# EAGLE design CTRL (EAGLE 7.6.0)
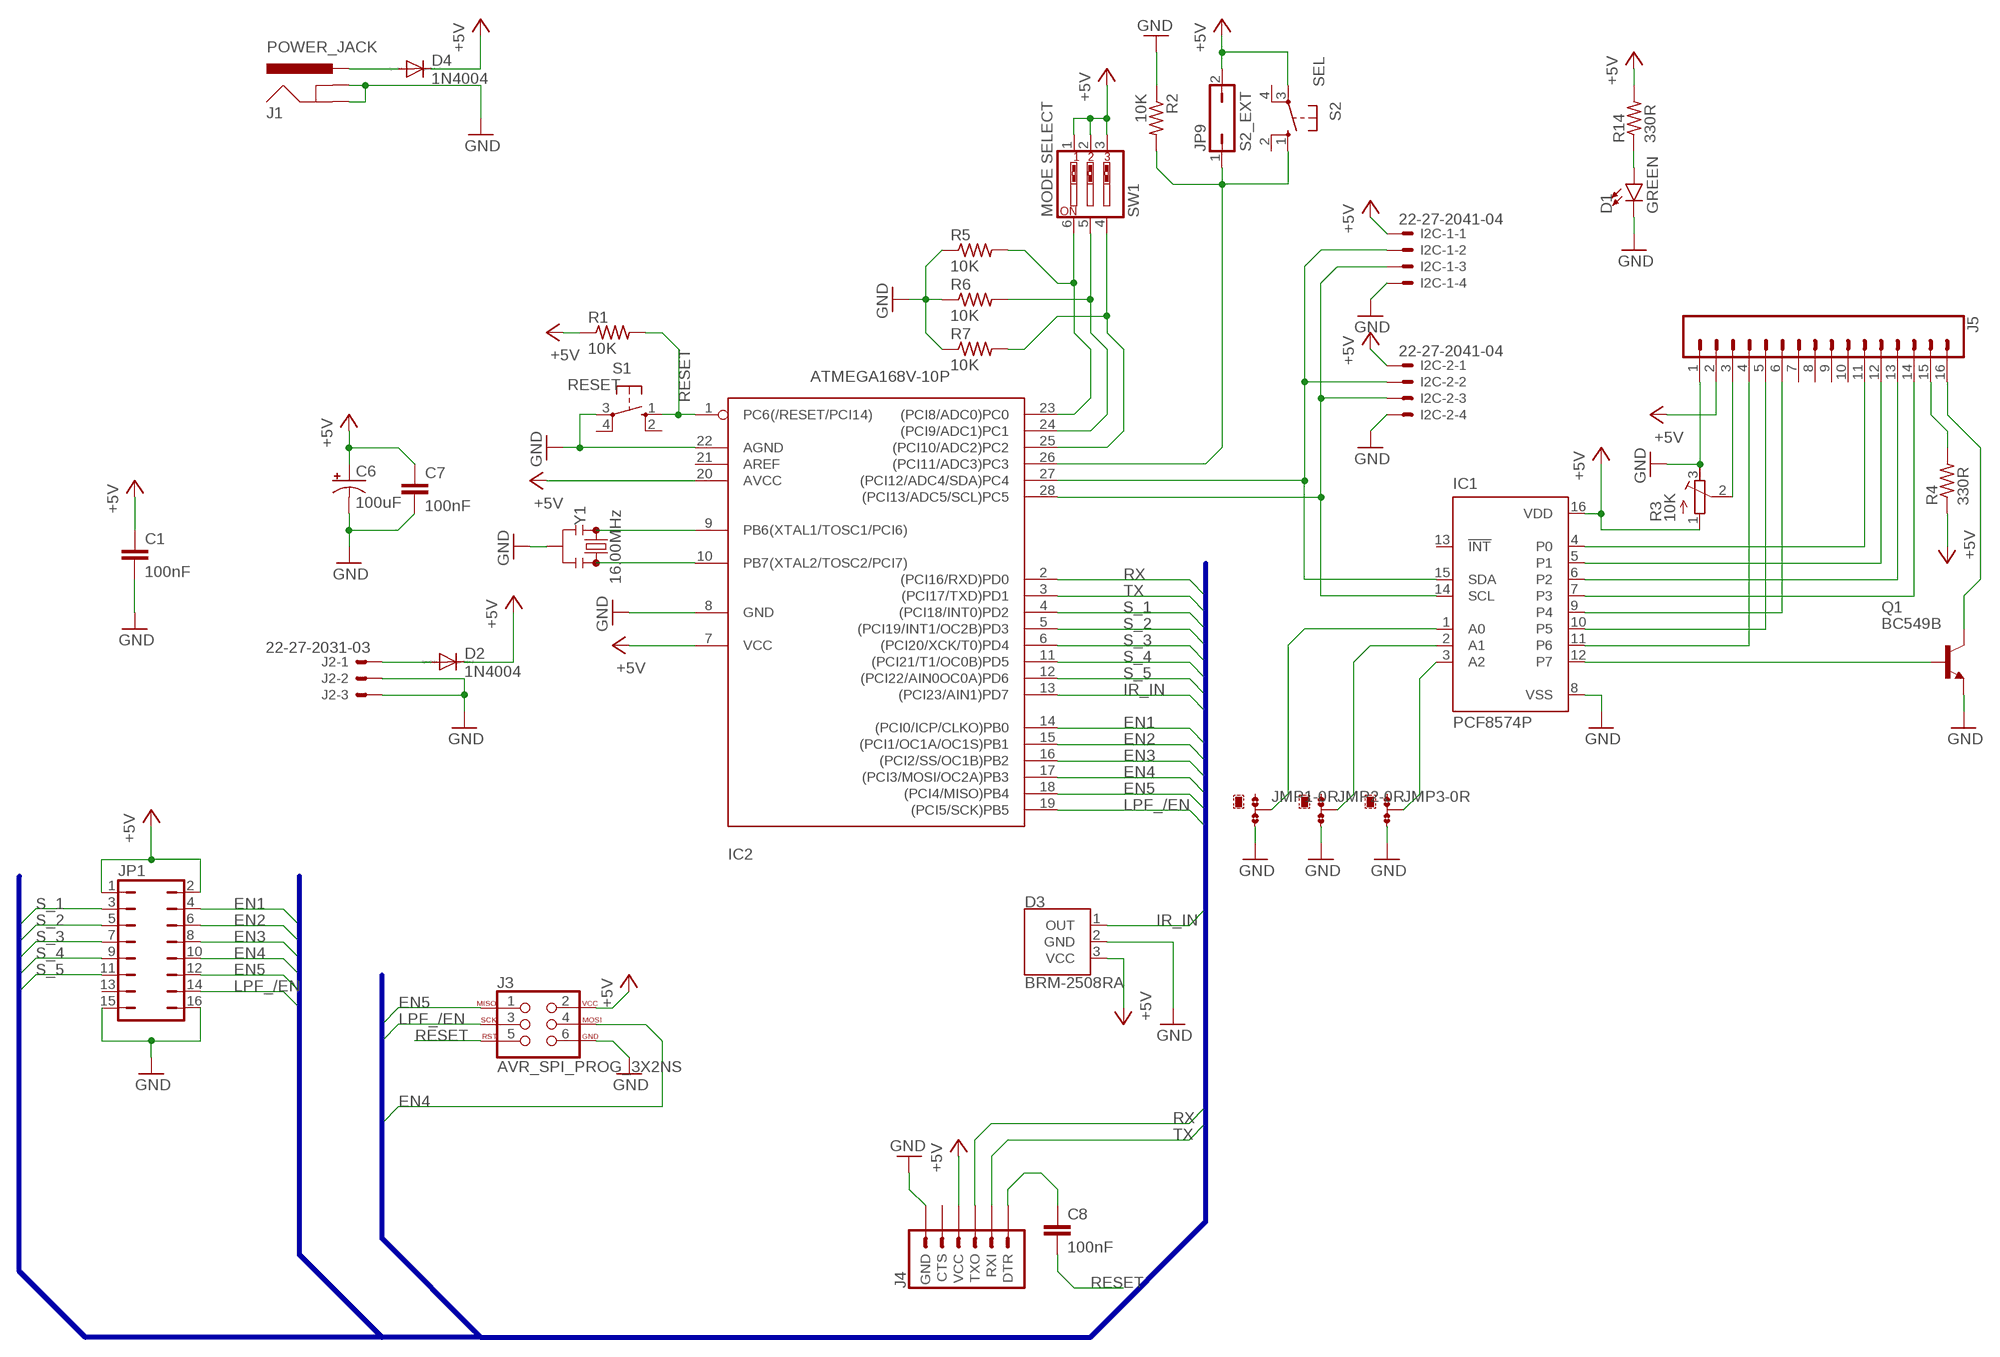
[diagram p0: schematic, sheet 1]

## Parts
C1  100nF  C-EU075-032X103  [C075-032X103]
C6  100uF  CPOL-USE2.5-7  [E2,5-7]
C7  100nF  C-EU075-032X103  [C075-032X103]
C8  100nF  C-EU075-032X103  [C075-032X103]
D1  GREEN  LED5MM  [LED_5MM]
D2  1N4004  [DO41-10]
D3  BRM-2508RA  [BRM-2508]
D4  1N4004  [DO41-10]
I2C-1  22-27-2041-04  [6410-04]
I2C-2  22-27-2041-04  [6410-04]
IC1  PCF8574P  [DIL16]
IC2  ATMEGA168V-10P  [DIL28-3]
J1  POWER_JACK  [POWER_JACK_PTH]
J2  22-27-2031-03  [6410-03]
J3  AVR_SPI_PROG_3X2NS  [2X3-NS]
J4  6_PIN_SERIAL_TARGETSILK  [6_PIN_SERIAL_TARGET_SIDE_W_SILK]
J5  CONN_16LONGPADS  [1X16_LONGPADS]
JMP1  0R-JUMPB  [B0R-JMP]
JMP2  0R-JUMPB  [B0R-JMP]
JMP3  0R-JUMPB  [B0R-JMP]
JP1  JP8Q  [JP8Q]
JP9  S2_EXT  JP1Q  [JP1]
Q1  BC549B  [TO92-EBC]
R1  10K  R-US_0204/7  [0204/7]
R2  10K  R-US_0204/7  [0204/7]
R3  10K  R-TRIMM3296P  [RTRIM3296P]
R4  330R  R-US_0204/7  [0204/7]
R5  10K  R-US_0204/7  [0204/7]
R6  10K  R-US_0204/7  [0204/7]
R7  10K  R-US_0204/7  [0204/7]
R14  330R  R-US_0204/7  [0204/7]
S1  RESET  10-XX  [B3F-10XX]
S2  SEL  10-XX  [B3F-10XX]
SW1  MODE SELECT  SW_DIP-3  [EDG-03]
Y1  16.00MHz  RESONATORPTH-7.6X3.8  [RESONATOR-PTH-7.6X3.8]

## Nets
+5V [PWR]: C1.1 C6.+ C7.1 D2.C D3.3(VCC) D4.C I2C-1.1 I2C-2.1 IC1.16(VDD) IC2.7(VCC) IC2.20(AVCC) J3.2 J4.P$4(VCC) J5.2 JP1.1 JP1.2 JP9.2 R1.1 R3.1(A) R4.1 R14.2 S2.3(P) SW1.1 SW1.2 SW1.3
EN1: IC2.14((PCI0/ICP/CLKO)PB0) JP1.4
EN2: IC2.15((PCI1/OC1A/OC1S)PB1) JP1.6
EN3: IC2.16((PCI2/SS/OC1B)PB2) JP1.8
EN4: IC2.17((PCI3/MOSI/OC2A)PB3) J3.4 JP1.10
EN5: IC2.18((PCI4/MISO)PB4) J3.1 JP1.12
GND: C1.2 C6.- C7.2 D1.K(C) D3.2(GND) I2C-1.4 I2C-2.4 IC1.8(VSS) IC2.8(GND) IC2.22(AGND) J1.GND J1.GNDBREAK J2.2 J2.3 J3.6 J4.P$6(GND) J5.1 JMP1.3 JMP2.3 JMP3.3 JP1.15 JP1.16 Q1.E R2.1 R3.3(E) R5.1 R6.1 R7.1 S1.3(P) Y1.2
IR_IN: D3.1(OUT) IC2.13((PCI23/AIN1)PD7)
LPF_/EN: IC2.19((PCI5/SCK)PB5) J3.3 JP1.14
N$1: IC2.9(PB6(XTAL1/TOSC1/PCI6)) Y1.1
N$2: IC2.10(PB7(XTAL2/TOSC2/PCI7)) Y1.3
N$5: IC1.1(A0) JMP1.2
N$6: IC1.2(A1) JMP2.2
N$7 [PWR]: D4.A J1.PWR
N$8: IC1.3(A2) JMP3.2
N$9: I2C-1.2 I2C-2.2 IC1.15(SDA) IC2.27((PCI12/ADC4/SDA)PC4)
N$10: I2C-1.3 I2C-2.3 IC1.14(SCL) IC2.28((PCI13/ADC5/SCL)PC5)
N$11: IC2.26((PCI11/ADC3)PC3) JP9.1 R2.2 S2.1(S)
N$12: IC2.23((PCI8/ADC0)PC0) R5.2 SW1.6
N$13: IC2.24((PCI9/ADC1)PC1) R6.2 SW1.5
N$14: IC2.25((PCI10/ADC2)PC2) R7.2 SW1.4
N$15: C8.1 J4.P$1(DTR)
N$16: D1.A R14.1
N$17 [PWR]: D2.A J2.1
N$18: IC1.4(P0) J5.11
N$19: IC1.5(P1) J5.12
N$20: IC1.6(P2) J5.13
N$21: IC1.7(P3) J5.14
N$22: IC1.9(P4) J5.6
N$23: IC1.10(P5) J5.5
N$24: IC1.11(P6) J5.4
N$25: J5.3 R3.2(S)
N$26: IC1.12(P7) Q1.B
N$27: J5.16 Q1.C
N$28: J5.15 R4.2
RESET: C8.2 IC2.1(PC6(/RESET/PCI14)) J3.5 R1.2 S1.1(S)
RX: IC2.2((PCI16/RXD)PD0) J4.P$2(TXO)
S_1: IC2.4((PCI18/INT0)PD2) JP1.3
S_2: IC2.5((PCI19/INT1/OC2B)PD3) JP1.5
S_3: IC2.6((PCI20/XCK/T0)PD4) JP1.7
S_4: IC2.11((PCI21/T1/OC0B)PD5) JP1.9
S_5: IC2.12((PCI22/AIN0OC0A)PD6) JP1.11
TX: IC2.3((PCI17/TXD)PD1) J4.P$3(RXI)
Unconnected: IC1.13(!INT) IC2.21(AREF) J4.P$5(CTS) J5.7 J5.8 J5.9 J5.10 JMP1.1 JMP2.1 JMP3.1 JP1.13 S1.2(S1) S1.4(P1) S2.2(S1) S2.4(P1)

## Buses
B$1

## Library data of the parts
C1 C7 C8 = rcl:C-EU: CAPACITOR, European symbol
C6 = rcl:CPOL-US: POLARIZED CAPACITOR, American symbol
D1 = SparkFun-LED:LED: LED (Generic) Standard schematic elements and footprints for 5mm, 3mm, 1206, and 0603 sized LEDs. Generic LEDs with no color specified.
D2 D4 = diode:1N4004: DIODE general purpose rectifier, 1 A
D3 = SparkFun-Sensors:BRM-2508: BRM-2508 IR Receiver Module 2.7V/5.5V IR Receiver with Low Power Consumption, High-immunity Against Ambient Light. Example Datasheet <http://www.sinoskysun.com/upload/20110512/201105120447164615.PDF>; PROD_ID: COMP-12059
I2C-1 I2C-2 = con-molex:22-?-04: CONNECTOR wire to board 2.54 mm (.1 inch) pitch header; OC_FARNELL: unknown; OC_NEWARK: unknown
IC1 = micro-philips:PCF8574: I2C-Bus Remote 8-bit I/O expander http://www.semiconductors.philips.com/acrobat_download/datasheets/PCF8574_4.pdf; MPN: PCF8574PN; OC_FARNELL: 204020; OC_NEWARK: 11N8515
IC2 = adafruit:ATMEGA168*P: MICROCONTROLLER 16 kBytes FLASH 1 kBytes SRAM 512 Bytes EEPROM USART 8-channel 10 bit ADC
J1 = SparkFun-Connectors:POWER_JACK: Power Jack Connector This is the standard 5.5mm barrel jack for power. The PTH is the most common, proven, reliable, footprint. The Slot footprint only works if the mill layer is transmitted to the PCB fab house so be warned. Here are the connectors we sell at SparkFun: DC Barrel Power Jack/Connector <https://www.sparkfun.com/products/119> (PRT-00119) DC Barrel Power Jack/Connector (SMD) <https://www.sparkfun.com/products/12748> (PRT-12748) DC Barrel Jack Adapter - Breadboard Compatible <https://www.sparkfun.com/products/10811> (PRT-10811) It is used on this SparkFun product (and many, many others): SparkFun RedBoard - Programmed with Arduino <https://www.sparkfun.com/products/12757> (DEV-12757) Also, if you need a mating power supply or connector, please check these out: Wall Adapter Power Supply - 9VDC 650mA <https://www.sparkfun.com/products/298> (TOL-00298) DC Barrel Jack Adapter - Male <https://www.sparkfun.com/products/10287> (PRT-10287); PROD_ID: CONN-08197
J2 = con-molex:22-?-03: CONNECTOR wire to board 2.54 mm (.1 inch) pitch header; OC_FARNELL: unknown; OC_NEWARK: unknown
J3 = SparkFun-Connectors:AVR_SPI_PROG_3X2: AVR ISP 6 Pin This is the reduced ISP connector for AVR programming. Common on Arduino. This footprint will take up less PCB space and can be used with a 10-pin to 6-pin adapter such as SKU: BOB-08508 **Special note about "TEST_POINT" package. The stop mask is on the top side, so if you want your programming test points to be on the bottom of your board, make sure to place this package on the bottom side of the board. This also ensure that the orientation to program from the bottom side will be correct. SparkFun Products: SparkFun ISP Pogo Adapter <https://www.sparkfun.com/products/11591> - NS Tiny AVR Programmer <https://www.sparkfun.com/products/11801> -PTH
J4 = SparkFun-Connectors:6_PIN_SERIAL_TARGET: 6-pin header connection for use with the "FTDI BASIC" pinout - TARGET SIDE. Also known as "Arduino Serial Program Header". It is used to mate with our FTDI Basic serial programmers using the Arduino IDE. Note, this device has "TARGET" in the name. It is intended to be used on a design that contains a target micro-controller that you wish to program. The "sister" device, named "CABLE" is inteneded to be used on a design that usually lives on the end of your USB cable and prvides the converter chip (FTDI232 or FTDI231x) to commnicate serial RX/TX. You can populate with some of these: Break Away Headers - Straight <https://www.sparkfun.com/products/116> (PRT-00116) For reference (or to suit your programming needs) check out these designs: SparkFun FTDI Basic Breakout - 5V <https://www.sparkfun.com/products/9716> (DEV-09716) SparkFun FTDI Basic Breakout - 3.3V <https://www.sparkfun.com/products/9873> (DEV-09873) SparkFun FTDI SmartBasic <https://www.sparkfun.com/products/12935> (DEV-12935) SparkFun Beefy 3 - FTDI Basic Breakout <https://www.sparkfun.com/products/13746> (DEV-13746)
J5 = SparkFun-Connectors:CONN_16: Multi connection point. Often used as Generic Header-pin footprint for 0.1 inch spaced/style header connections On any of the 0.1 inch spaced packages, you can populate with these: Break Away Headers - Straight <https://www.sparkfun.com/products/116> (PRT-00116) Break Away Male Headers - Right Angle <https://www.sparkfun.com/products/553> (PRT-00553) Female Headers <https://www.sparkfun.com/products/115> (PRT-00115) Break Away Headers - Machine Pin <https://www.sparkfun.com/products/117> (PRT-00117) Break Away Female Headers - Swiss Machine Pin <https://www.sparkfun.com/products/743> (PRT-00743) For SCREWTERMINALS and SPRING TERMINALS visit here: Screw Terimnals on SparkFun.com <https://www.sparkfun.com/search/results?term=Screw+Terminals> (5mm/3.5mm/2.54mm spacing) This device is also useful as a general connection point to wire up your design to another part of your project. Our various solder wires solder well into these plated through hole pads. Hook-Up Wire - Assortment (Stranded, 22 AWG) <https://www.sparkfun.com/products/11375> (PRT-11375) Hook-Up Wire - Assortment (Solid Core, 22 AWG) <https://www.sparkfun.com/products/11367> (PRT-11367) View the entire wire category on our website here <https://www.sparkfun.com/categories/141> Special notes: Molex polarized connector foot print use with SKU : PRT-08231 with associated crimp pins and housings. 1MM SMD Version SKU: PRT-10208 NOTES ON THE VARIANTS LOCK and LOCK_LONGPADS... This footprint was designed to help hold the alignment of a through-hole component (i.e. 6-pin header) while soldering it into place. You may notice that each hole has been shifted either up or down by 0.005 of an inch from it's more standard position (which is a perfectly straight line). This slight alteration caused the pins (the squares in the middle) to touch the edges of the holes. Because they are alternating, it causes a "brace" to hold the component in place. 0.005 has proven to be the perfect amount of "off-center" position when using our standard breakaway headers. Although looks a little odd when you look at the bare footprint, once you have a header in there, the alteration is very hard to notice. Also,if you push a header all the way into place, it is covered up entirely on the bottom side.
JMP1-JMP3 = jump-0r-smd:0R-JUMP: SMD 0R 0805 Jumper
JP1 = jumper:JP8Q: JUMPER
JP9 = jumper:JP1Q: JUMPER
Q1 = transistor-npn:BC549*: NPN Transistor
R1 R2 R5-R7 = rcl:R-US_: RESISTOR, American symbol
R3 = resistor:R-TRIMM: Trimm resistor
R4 R14 = resistor:R-US_: RESISTOR, American symbol
S1 S2 = switch-omron:10-XX: OMRON SWITCH; MPN: B3F-1000; OC_FARNELL: 176432; OC_NEWARK: 36M3542
SW1 = special:SW_DIP-3: DIP SWITCH
Y1 = SparkFun-Clocks:RESONATOR: Resonators (Generic) Ceramic resonators are clock-generating components, often used to control timing in microcontrollers. They usually have 3 pins: two pins for oscillation, and one pin for ground. Compared to crystals, resonators have worse tolerance, but are usually much cheaper. Plus, they have built-in load capacitors! These devices are used on boards like the Arduino Pro 8MHz <https://www.sparkfun.com/products/11114> and Arduino Pro 16MHz <https://www.sparkfun.com/products/11113>.

## Net classes
0 default: width 0.406 mm
1 PWR: width 1 mm

## Board
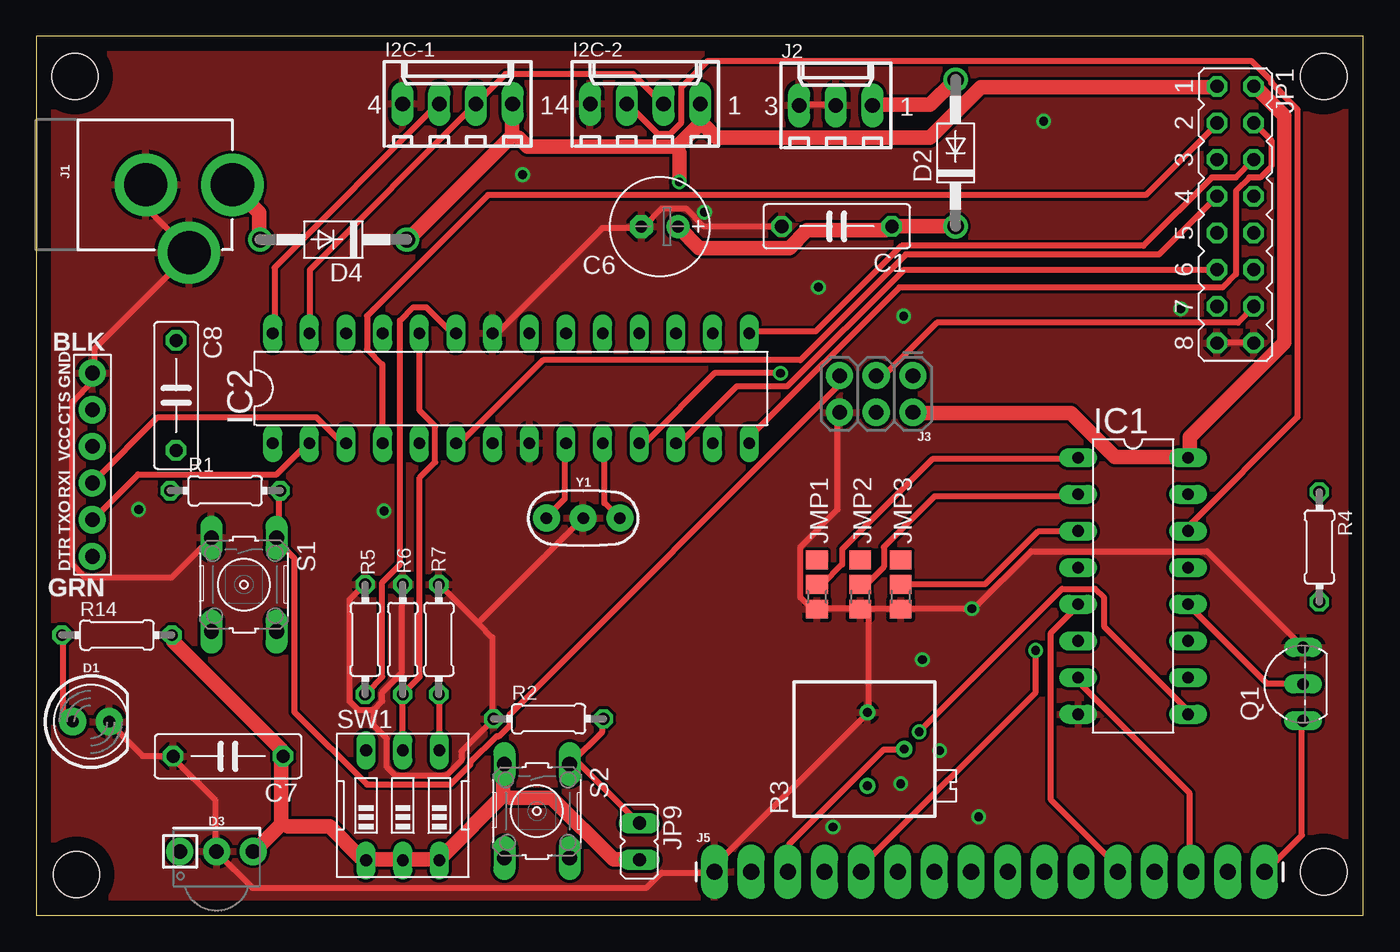
[diagram p1: board, top side]
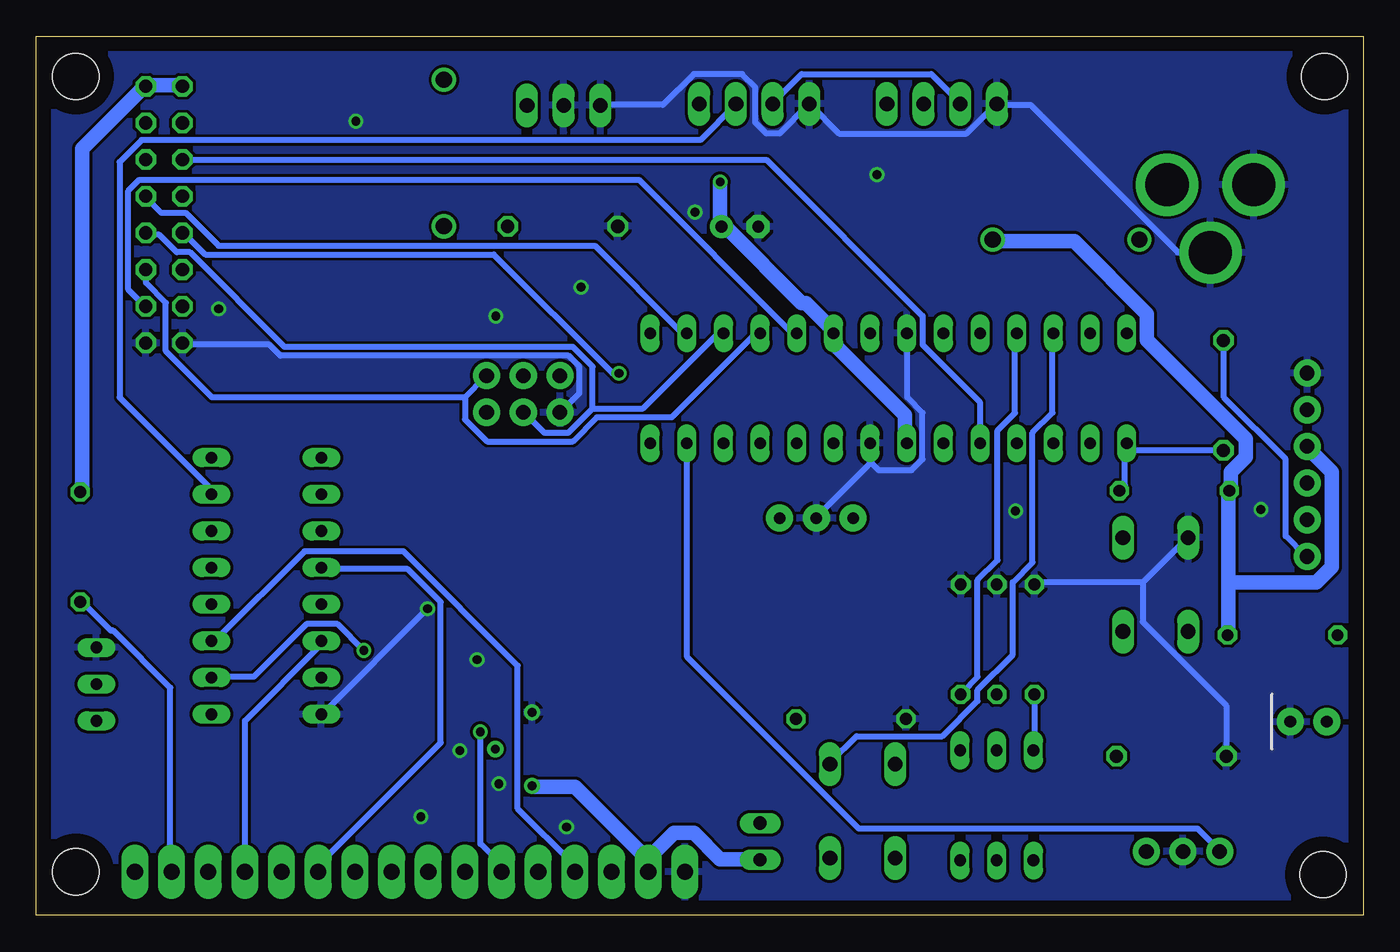
[diagram p2: board, bottom side, seen from below]

Size 91.95 x 60.93 mm. Coordinates in mm from the lower left corner, seen from the top.
Outline: 0,0 91.95,0 91.95,60.93 0,60.93 0,0
Copper layers (1*16): Top 0.035mm / dielectric 1.5mm / Bottom 0.035mm
Design rules "default": minimum track width 10mil, minimum drill 24mil, track to track 8mil, track to pad 8mil, pad to pad 8mil, via to via 8mil, smd to smd 8mil, copper to edge 40mil, drill to drill 8mil, minimum pad ring 10mil, minimum via ring 8mil, stop-mask expansion 4mil, vias tented up to drill 0mil, thermal gap 10mil
Holes 3.2 mm at 2.7,58.13 2.8,2.83 89.2,3.03 89.2,58.13

### Footprints (pad centres in the part's own frame; a part is rotated, then mirrored left to right if it is on the bottom)
C075-032X103 = drill 0.914 octagon: 1 -3.81,0; 2 3.81,0
E2,5-7 = drill 0.813 pad 1.6: + -1.27,0 | drill 0.813 pad 1.6 octagon: - 1.27,0
LED_5MM = drill 0.813 pad 1.88: A -1.27,0; K 1.27,0
DO41-10 = drill 1.118: A 5.08,0; C -5.08,0
BRM-2508 = drill 1.016 pad 1.88: 1 -2.54,0; 2 0,0; 3 2.54,0
6410-04 = drill 1.016 long: 1 3.81,0; 2 1.27,0; 3 -1.27,0; 4 -3.81,0
DIL16 = drill 0.813 long: 1 -8.89,-3.81; 2 -6.35,-3.81; 3 -3.81,-3.81; 4 -1.27,-3.81; 5 1.27,-3.81; 6 3.81,-3.81; 7 6.35,-3.81; 8 8.89,-3.81; 9 8.89,3.81; 10 6.35,3.81; 11 3.81,3.81; 12 1.27,3.81; 13 -1.27,3.81; 14 -3.81,3.81; 15 -6.35,3.81; 16 -8.89,3.81
DIL28-3 = drill 0.813 long: 1 -16.51,-3.81; 2 -13.97,-3.81; 3 -11.43,-3.81; 4 -8.89,-3.81; 5 -6.35,-3.81; 6 -3.81,-3.81; 7 -1.27,-3.81; 8 1.27,-3.81; 9 3.81,-3.81; 10 6.35,-3.81; 11 8.89,-3.81; 12 11.43,-3.81; 13 13.97,-3.81; 14 16.51,-3.81; 15 16.51,3.81; 16 13.97,3.81; 17 11.43,3.81; 18 8.89,3.81; 19 6.35,3.81; 20 3.81,3.81; 21 1.27,3.81; 22 -1.27,3.81; 23 -3.81,3.81; 24 -6.35,3.81; 25 -8.89,3.81; 26 -11.43,3.81; 27 -13.97,3.81; 28 -16.51,3.81
POWER_JACK_PTH = drill 2.997 pad 4.318: GND 0,7.7; GNDBREAK 4.7,10.7; PWR 0,13.7
6410-03 = drill 1.016 long: 1 2.54,0; 2 0,0; 3 -2.54,0
2X3-NS = drill 1.016 pad 1.88: 1 -2.54,-1.27; 2 -2.54,1.27; 3 0,-1.27; 4 0,1.27; 5 2.54,-1.27; 6 2.54,1.27
6_PIN_SERIAL_TARGET_SIDE_W_SILK = drill 1.016 pad 1.88: P$1 -6.35,0; P$2 -3.81,0; P$3 -1.27,0; P$4 1.27,0; P$5 3.81,0; P$6 6.35,0
1X16_LONGPADS = drill 1.118 pad 1.88 long: 1 0,0; 2 2.54,0; 3 5.08,0; 4 7.62,0; 5 10.16,0; 6 12.7,0; 7 15.24,0; 8 17.78,0; 9 20.32,0; 10 22.86,0; 11 25.4,0; 12 27.94,0; 13 30.48,0; 14 33.02,0; 15 35.56,0; 16 38.1,0
B0R-JMP = smd 1.5 x 1.3: 1 0,1.7; 2 0,0; 3 0,-1.7
JP8Q = drill 0.914 octagon: 1 -8.89,-1.27; 2 -8.89,1.27; 3 -6.35,-1.27; 4 -6.35,1.27; 5 -3.81,-1.27; 6 -3.81,1.27; 7 -1.27,-1.27; 8 -1.27,1.27; 9 1.27,-1.27; 10 1.27,1.27; 11 3.81,-1.27; 12 3.81,1.27; 13 6.35,-1.27; 14 6.35,1.27; 15 8.89,-1.27; 16 8.89,1.27
JP1 = drill 0.914 long: 1 0,-1.27; 2 0,1.27
TO92-EBC = drill 0.813 long: B 0,-1.27; C -2.54,-1.27; E 2.54,-1.27
0204/7 = drill 0.813 octagon: 1 -3.81,0; 2 3.81,0
RTRIM3296P = drill 0.61: 1 0,-2.54; 2 2.54,0; 3 0,2.54
B3F-10XX = drill 1.016 long: 1 -3.251,2.261; 2 3.251,2.261; 3 -3.251,-2.261; 4 3.251,-2.261
EDG-03 = drill 0.813 long: 1 -2.54,-3.81; 2 0,-3.81; 3 2.54,-3.81; 4 2.54,3.81; 5 0,3.81; 6 -2.54,3.81
RESONATOR-PTH-7.6X3.8 = drill 0.8 pad 1.88: 1 -2.54,0; 2 0,0; 3 2.54,0

### Placement (x,y rotation side)
C1  55.47,47.75 180 top
C6  43.2,47.73 180 top
C7  13.3,11.03 180 top
C8  9.7,36.03 270 top
D1  3.8,13.43 0 top
D2  63.7,52.83 90 top
D3  12.5,4.43 0 top
D4  20.6,46.83 180 top
I2C-1  29.2,56.23 0 top
I2C-2  42.2,56.23 0 top
IC1  76,22.83 270 top
IC2  32.9,36.53 0 top
J1  -0.1,50.63 270 top
J2  55.4,56.13 0 top
J3  58.2,36.13 180 top
J4  3.9,31.23 90 top
J5  47,3.03 0 top
JMP1  54.1,22.93 0 top
JMP2  57.1,22.93 0 top
JMP3  59.9,22.93 0 top
JP1  83.08,48.56 270 top
JP9  41.8,5.13 180 top
Q1  86.5,16.03 90 top
R1  13.1,29.43 0 top
R2  35.5,13.63 0 top
R3  57.6,11.53 0 top
R4  88.9,25.53 270 top
R5  22.8,19.13 270 top
R6  25.4,19.13 270 top
R7  27.9,19.13 270 top
R14  5.6,19.43 0 top
S1  14.4,22.93 270 top
S2  34.7,7.23 270 top
SW1  25.4,7.63 0 top
Y1  37.9,27.53 0 top

### Tracks (layer width: path | path; a pad name or v marks a point on that pad's centre or on a via)
+5V  (via drill 0.61)
  Top 1: 16.97,6.33 16.97,10.9 C7.1 16.97,11.51 9.51,18.98 9.51,19.28 R14.2 | 16.97,6.33 15.14,4.5 D3.3 | 32.37,8.31 32.37,10.44 S2.3 | 32.37,8.31 28.25,4.19 SW1.3 27.79,3.89 25.81,3.89 SW1.2 25.36,3.89 22.92,3.89 SW1.1 22.46,4.04 20.33,6.17 17.43,6.17 16.97,6.33 | JP9.2 41.66,3.89 39.99,3.89 35.72,8.15 32.82,8.15 32.37,8.31 | J3.2 60.87,34.82 71.68,34.82 74.73,31.78 79.76,31.78 IC1.16 79.91,32.23 79.91,33.15 86.47,39.7 86.47,55.4 84.49,57.38 JP1.2 | 32.98,54.03 32.98,56.16 I2C-1.1 | 32.98,54.03 25.81,46.86 D4.C | 45.93,54.79 45.93,56.16 I2C-2.1 | 44.41,53.26 45.93,54.79 | 44.41,53.26 34.04,53.26 33.43,53.88 32.98,54.03 | D2.C 63.61,47.78 59.34,47.78 C1.1 58.88,47.47 53.4,47.47 52.18,46.25 45.93,46.25 44.56,47.63 C6.+ | v44.56,50.83 44.56,52.81 44.41,53.26 | JP1.1 81.74,57.38 65.44,57.38 61.93,53.88 47.15,53.88 46.39,54.64 45.93,54.79
  Bottom 1: R3.1 57.51,8.92 54.62,8.92 49.59,3.89 49.59,3.13 J5.2 49.28,4.19 47.76,5.72 46.39,5.72 44.56,3.89 41.82,3.89 JP9.2 | 9.35,23.09 9.35,19.43 R14.2 | 9.35,23.09 9.35,29.34 R1.1 9.2,29.95 9.2,30.71 8.13,31.78 8.13,33 14.99,39.85 14.99,41.68 20.02,46.71 25.66,46.71 D4.C | 9.35,23.09 3.26,23.09 2.19,24.16 2.19,30.71 3.87,32.39 J4.P$4 | R4.1 88.75,29.49 88.75,53.11 84.49,57.38 JP1.2 83.88,57.53 81.9,57.53 JP1.1 | IC2.7 31.76,32.84 31.76,34.67 36.63,39.55 36.63,40.31 IC2.20 36.94,40.77 38.61,42.45 38.92,42.45 44.1,47.63 44.41,47.63 C6.+ 44.56,48.24 v44.56,50.83
EN1
  Top 0.406: IC2.14 49.44,32.84 49.44,33.15 59.8,43.51 82.2,43.51 83.11,44.43 83.11,50.22 84.03,51.13 84.79,51.13 85.55,51.89 85.55,53.72 84.49,54.79 JP1.4
EN2
  Top 0.406: IC2.15 49.44,40.46 54.01,40.46 59.95,46.41 76.71,46.41 81.44,51.13 83.11,51.13 84.33,52.35 JP1.6
EN3
  Bottom 0.406: IC2.16 47,40.46 47.3,40.46 53.25,46.41 79.3,46.41 81.59,48.69 83.27,48.69 84.33,49.76 JP1.8
EN4
  Bottom 0.406: 53.4,35.13 49.89,35.13 44.71,40.31 44.41,40.31 IC2.17 | 53.4,35.13 55.07,33.45 56.75,33.45 58.12,34.82 J3.4 | 53.4,35.13 53.4,38.02 54.77,39.4 74.73,39.4 81.29,45.95 82.2,45.95 83.42,47.17 84.33,47.17 JP1.10
EN5
  Bottom 0.406: 62.24,35.89 62.24,34.37 60.71,32.84 54.77,32.84 53.09,34.52 47.91,34.52 42.12,40.31 41.82,40.31 IC2.18 | 62.24,35.89 60.87,37.26 J3.1 | 62.24,35.89 79.76,35.89 82.96,39.09 82.96,42.45 84.33,43.82 84.33,44.73 JP1.12
GND  (via drill 0.61)
  Top 0.406: JP1.15 81.9,39.7 84.33,39.7 JP1.16 | JMP2.3 57.05,21.26 54.16,21.26 JMP1.3 54.01,21.26 53.7,21.26 52.94,22.02 52.94,25.53 55.53,28.12 55.53,34.82 J3.6 | JMP2.3 57.21,21.26 59.8,21.26 JMP3.3 60.1,21.26 v64.83,21.26 64.98,21.26 68.94,25.22 81.13,25.22 87.69,18.67 Q1.E | JMP2.3 57.66,21.11 57.66,14.1 R3.3 57.51,13.95 47.15,3.58 47.15,3.13 J5.1 46.84,2.97 43.34,2.97 42.27,1.91 14.99,1.91 12.55,4.35 D3.2 12.4,4.5 12.4,8 9.51,10.9 C7.2 9.35,11.05 7.37,11.05 5.09,13.34 D1.K | J1.GND 7.68,50.52 7.68,49 10.57,46.1 J1.GNDBREAK 10.57,45.8 4.02,39.24 4.02,37.72 J4.P$6 3.87,37.42 3.87,36.96 2.5,35.59 2.5,24.31 3.41,23.39 9.35,23.39 12.1,26.14 S1.3 | J2.3 52.94,56.16 55.38,56.16 J2.2 | 23.37,14.25 23.98,14.86 23.98,15.47 25.36,16.84 25.36,22.94 R6.1 | 23.37,14.25 22.31,14.25 21.7,14.86 21.7,21.87 22.77,22.94 R5.1 | IC2.22 31.76,40.46 32.06,40.46 39.22,47.63 41.82,47.63 C6.- 42.12,47.78 43.34,49 45.02,49 46.23,47.78 51.57,47.78 C1.2 | 30.61,20.27 27.95,22.94 R7.1 | 30.61,20.27 31.6,19.28 31.6,13.64 R2.1 31.6,13.49 29.47,11.36 29.47,10.75 28.4,9.68 24.9,9.68 24.29,10.29 24.29,12.27 23.37,13.18 23.37,14.25 | 30.61,20.27 37.85,27.51 Y1.2
  Bottom 0.406: JP1.15 81.74,39.55 75.8,39.55 75.04,38.79 55.07,38.79 54.31,38.02 54.31,36.2 55.53,34.98 J3.6 | v64.83,21.26 72.14,13.95 IC1.8 | J2.3 52.79,56.16 48.52,56.16 46.39,58.29 43.03,58.29 42.12,57.38 42.12,54.94 41.36,54.18 40.44,54.18 38.46,56.16 I2C-2.4 38.31,56.16 36.33,54.18 27.49,54.18 25.51,56.16 I2C-1.4 25.2,56.16 23.07,56.16 12.86,45.95 10.72,45.95 J1.GNDBREAK | 15.3,23.09 22.77,23.09 R5.1 | 15.3,23.09 12.25,26.14 S1.3 | 15.3,23.09 15.3,20.35 9.51,14.56 9.51,11.05 C7.2 | 34.2,31.32 34.2,32.69 IC2.8 | 34.2,31.32 37.85,27.66 Y1.2 | IC2.22 31.6,40.31 31.6,35.89 30.54,34.82 30.54,31.62 31.3,30.86 33.59,30.86 34.04,31.32 34.2,31.32
  other vias: 33.7,51.33 46.3,48.73 69.8,55.03 54.2,43.53 79.3,42.03 60.1,41.53 61.4,17.73 62.6,11.43 65.3,6.83 59.9,9.13 55.2,6.13 7.1,28.13 24.1,28.03
  pour Bottom: 0,60.93 92,60.93 92,0.33 0,0.33
  pour Top: 0,60.93 92,60.93 92,0.33 0,0.33
IR_IN
  Bottom 0.406: IC2.13 46.84,32.69 46.84,17.91 34.96,6.02 11.49,6.02 9.96,4.5 D3.1
LPF_/EN
  Top 0.406: J3.3 58.27,37.42 58.73,37.42 62.39,41.07 83.27,41.07 84.33,42.14 JP1.14
  Bottom 0.406: IC2.19 39.38,40.46 39.68,40.46 50.2,50.98 84.79,50.98 85.55,50.22 85.55,43.36 84.49,42.29 JP1.14
N$1
  Top 0.406: IC2.9 36.63,32.69 36.63,28.88 35.41,27.66 Y1.1
N$2
  Top 0.406: IC2.10 39.38,32.69 39.38,28.58 40.29,27.66 Y1.3
N$5
  Top 0.406: JMP1.2 54.16,22.94 54.46,22.94 55.84,24.31 55.84,25.38 62.08,31.62 72.14,31.62 IC1.1
N$6
  Top 0.406: JMP2.2 57.21,22.94 57.51,22.94 58.73,24.16 58.73,25.53 62.24,29.03 72.14,29.03 IC1.2
N$7
  Top 1: D4.A 15.45,46.86 15.45,48.69 13.62,50.52 J1.PWR
N$8
  Top 0.406: JMP3.2 59.95,22.94 65.74,22.94 69.4,26.59 72.14,26.59 IC1.3
N$9
  Top 0.406: IC2.27 18.96,40.46 18.96,44.73 30.39,56.16 I2C-1.2 30.54,56.31 32.52,58.29 41.36,58.29 43.34,56.31 I2C-2.2
  Bottom 0.406: IC1.15 79.91,29.19 79.91,29.64 86.16,35.89 86.16,52.2 84.64,53.72 45.93,53.72 43.49,56.16 I2C-2.2
N$10
  Top 0.406: IC2.28 16.52,40.46 16.52,44.88 27.79,56.16 I2C-1.3 | IC1.14 79.91,26.75 79.91,27.05 87.38,34.52 87.38,55.86 85.55,57.68 85.55,57.84 84.18,59.21 46.54,59.21 44.71,57.38 44.71,54.94 43.95,54.18 43.03,54.18 41.05,56.16 I2C-2.3
  Bottom 0.406: I2C-1.3 27.95,56.31 29.93,58.29 38.92,58.29 40.9,56.31 I2C-2.3
N$11
  Top 0.406: R2.2 39.22,13.49 39.22,12.73 37.09,10.59 S2.1 37.4,10.75 41.66,6.48 JP9.1
  Bottom 0.406: IC2.26 21.55,40.31 21.55,34.82 22.92,33.45 22.92,24.46 24.29,23.09 24.29,18.06 26.73,15.62 26.73,14.86 29.17,12.42 35.11,12.42 36.94,10.59 S2.1
N$12
  Top 0.406: IC2.23 29.01,40.46 28.71,40.46 27.03,42.14 26.12,42.14 25.2,41.23 25.2,24.31 23.98,23.09 23.98,16.54 22.92,15.47 R5.2
  Bottom 0.406: R5.2 22.77,15.32 22.77,11.51 SW1.6
N$13
  Top 0.406: SW1.5 25.36,11.51 25.36,15.32 R6.2 25.51,15.47 26.58,16.54 26.58,30.34 27.64,31.41 27.64,33.91 26.58,34.98 26.58,40.31 IC2.24
N$14
  Top 0.406: R7.2 27.95,15.32 27.95,11.51 SW1.4
  Bottom 0.406: IC2.25 24.14,40.31 24.14,34.82 25.36,33.61 25.36,24.61 26.73,23.24 26.73,16.54 27.79,15.47 R7.2
N$15
  Bottom 0.406: C8.1 9.66,39.7 9.66,35.89 5.39,31.62 5.39,26.29 4.02,24.92 J4.P$1
N$16
  Top 0.406: R14.1 1.89,19.28 1.89,14.1 2.5,13.49 D1.A
N$17
  Top 1: J2.1 57.97,56.16 61.93,56.16 63.61,57.84 D2.A
N$18
  Bottom 0.406: IC1.4 72.14,24 66.2,24 63.91,21.72 63.91,11.96 72.29,3.58 72.29,3.13 J5.11
N$19
  Top 0.406: IC1.5 72.14,21.41 70.31,19.59 70.31,8 74.89,3.43 74.89,3.13 J5.12
N$20
  Bottom 0.406: IC1.6 72.29,18.98 72.29,18.67 77.48,13.49 77.48,3.13 J5.13
N$21
  Top 0.406: IC1.7 72.29,16.38 72.29,16.08 79.91,8.46 79.91,3.13 J5.14
N$22  (via drill 0.61)
  Top 0.406: v61.17,12.73 71.08,22.63 73.36,22.63 73.97,22.02 73.97,20.04 79.76,14.25 79.76,13.95 IC1.9
  Bottom 0.406: v61.17,12.73 61.17,4.95 59.8,3.58 59.8,3.13 J5.6
N$23  (via drill 0.61)
  Top 0.406: v69.25,18.37 69.25,15.47 57.21,3.43 57.21,3.13 J5.5
  Bottom 0.406: v69.25,18.37 71.08,20.19 73.21,20.19 76.87,16.54 79.76,16.54 IC1.10
N$24
  Bottom 0.406: IC1.11 79.76,19.13 79.46,19.13 73.36,25.22 66.5,25.22 58.58,17.3 58.58,7.39 54.77,3.58 54.77,3.13 J5.4
N$25
  Top 0.406: R3.2 60.1,11.51 58.73,11.51 52.18,4.95 52.18,3.13 J5.3
N$26
  Top 0.406: Q1.B 87.69,16.08 85.25,16.08 79.91,21.41 IC1.12
N$27
  Top 0.406: Q1.C 87.69,13.49 87.69,5.56 85.25,3.13 J5.16
N$28
  Bottom 0.406: R4.2 88.75,21.72 86.77,19.74 86.62,19.74 82.66,15.78 82.66,3.13 J5.15
RESET
  Top 0.406: R1.2 16.82,29.34 16.82,26.44 16.67,26.29 S1.1 16.67,25.99 17.89,24.77 17.89,14.1 22.92,9.07 28.71,9.07 30.08,10.44 30.08,10.59 31.91,12.42 32.06,12.42 32.82,13.18 32.82,13.95 55.53,36.65 55.53,37.26 J3.5
  Bottom 0.406: R1.2 16.82,29.49 16.52,29.8 16.52,32.69 IC2.1 16.36,32.23 9.81,32.23 C8.2
RX
  Top 0.406: IC2.2 18.8,32.69 16.67,30.56 7.07,30.56 4.02,27.51 J4.P$2
S_1
  Top 0.406: IC2.4 23.98,32.84 23.98,38.18 22.92,39.24 22.92,41.53 31.3,49.91 76.87,49.91 81.74,54.79 JP1.3
S_2
  Bottom 0.406: IC2.5 26.58,32.84 26.58,35.59 30.54,39.55 30.54,41.53 41.36,52.35 81.74,52.35 JP1.5
S_3
  Top 0.406: IC2.6 29.17,32.84 29.47,32.84 35.11,38.48 52.94,38.48 60.26,45.8 77.78,45.8 81.74,49.76 JP1.7
S_4  (via drill 0.61)
  Top 0.406: v51.57,37.57 47,37.57 42.27,32.84 41.82,32.84 IC2.11
  Bottom 0.406: v51.57,37.57 52.03,37.57 60.26,45.8 80.22,45.8 81.74,47.32 JP1.9
S_5
  Top 0.406: IC2.12 44.41,32.84 44.71,32.84 48.52,36.65 52.03,36.65 60.1,44.73 81.74,44.73 JP1.11
TX
  Top 0.406: IC2.3 21.39,32.84 21.09,32.84 19.41,34.52 8.44,34.52 4.02,30.1 J4.P$3